# Altium project Micromouse.PrjPcb
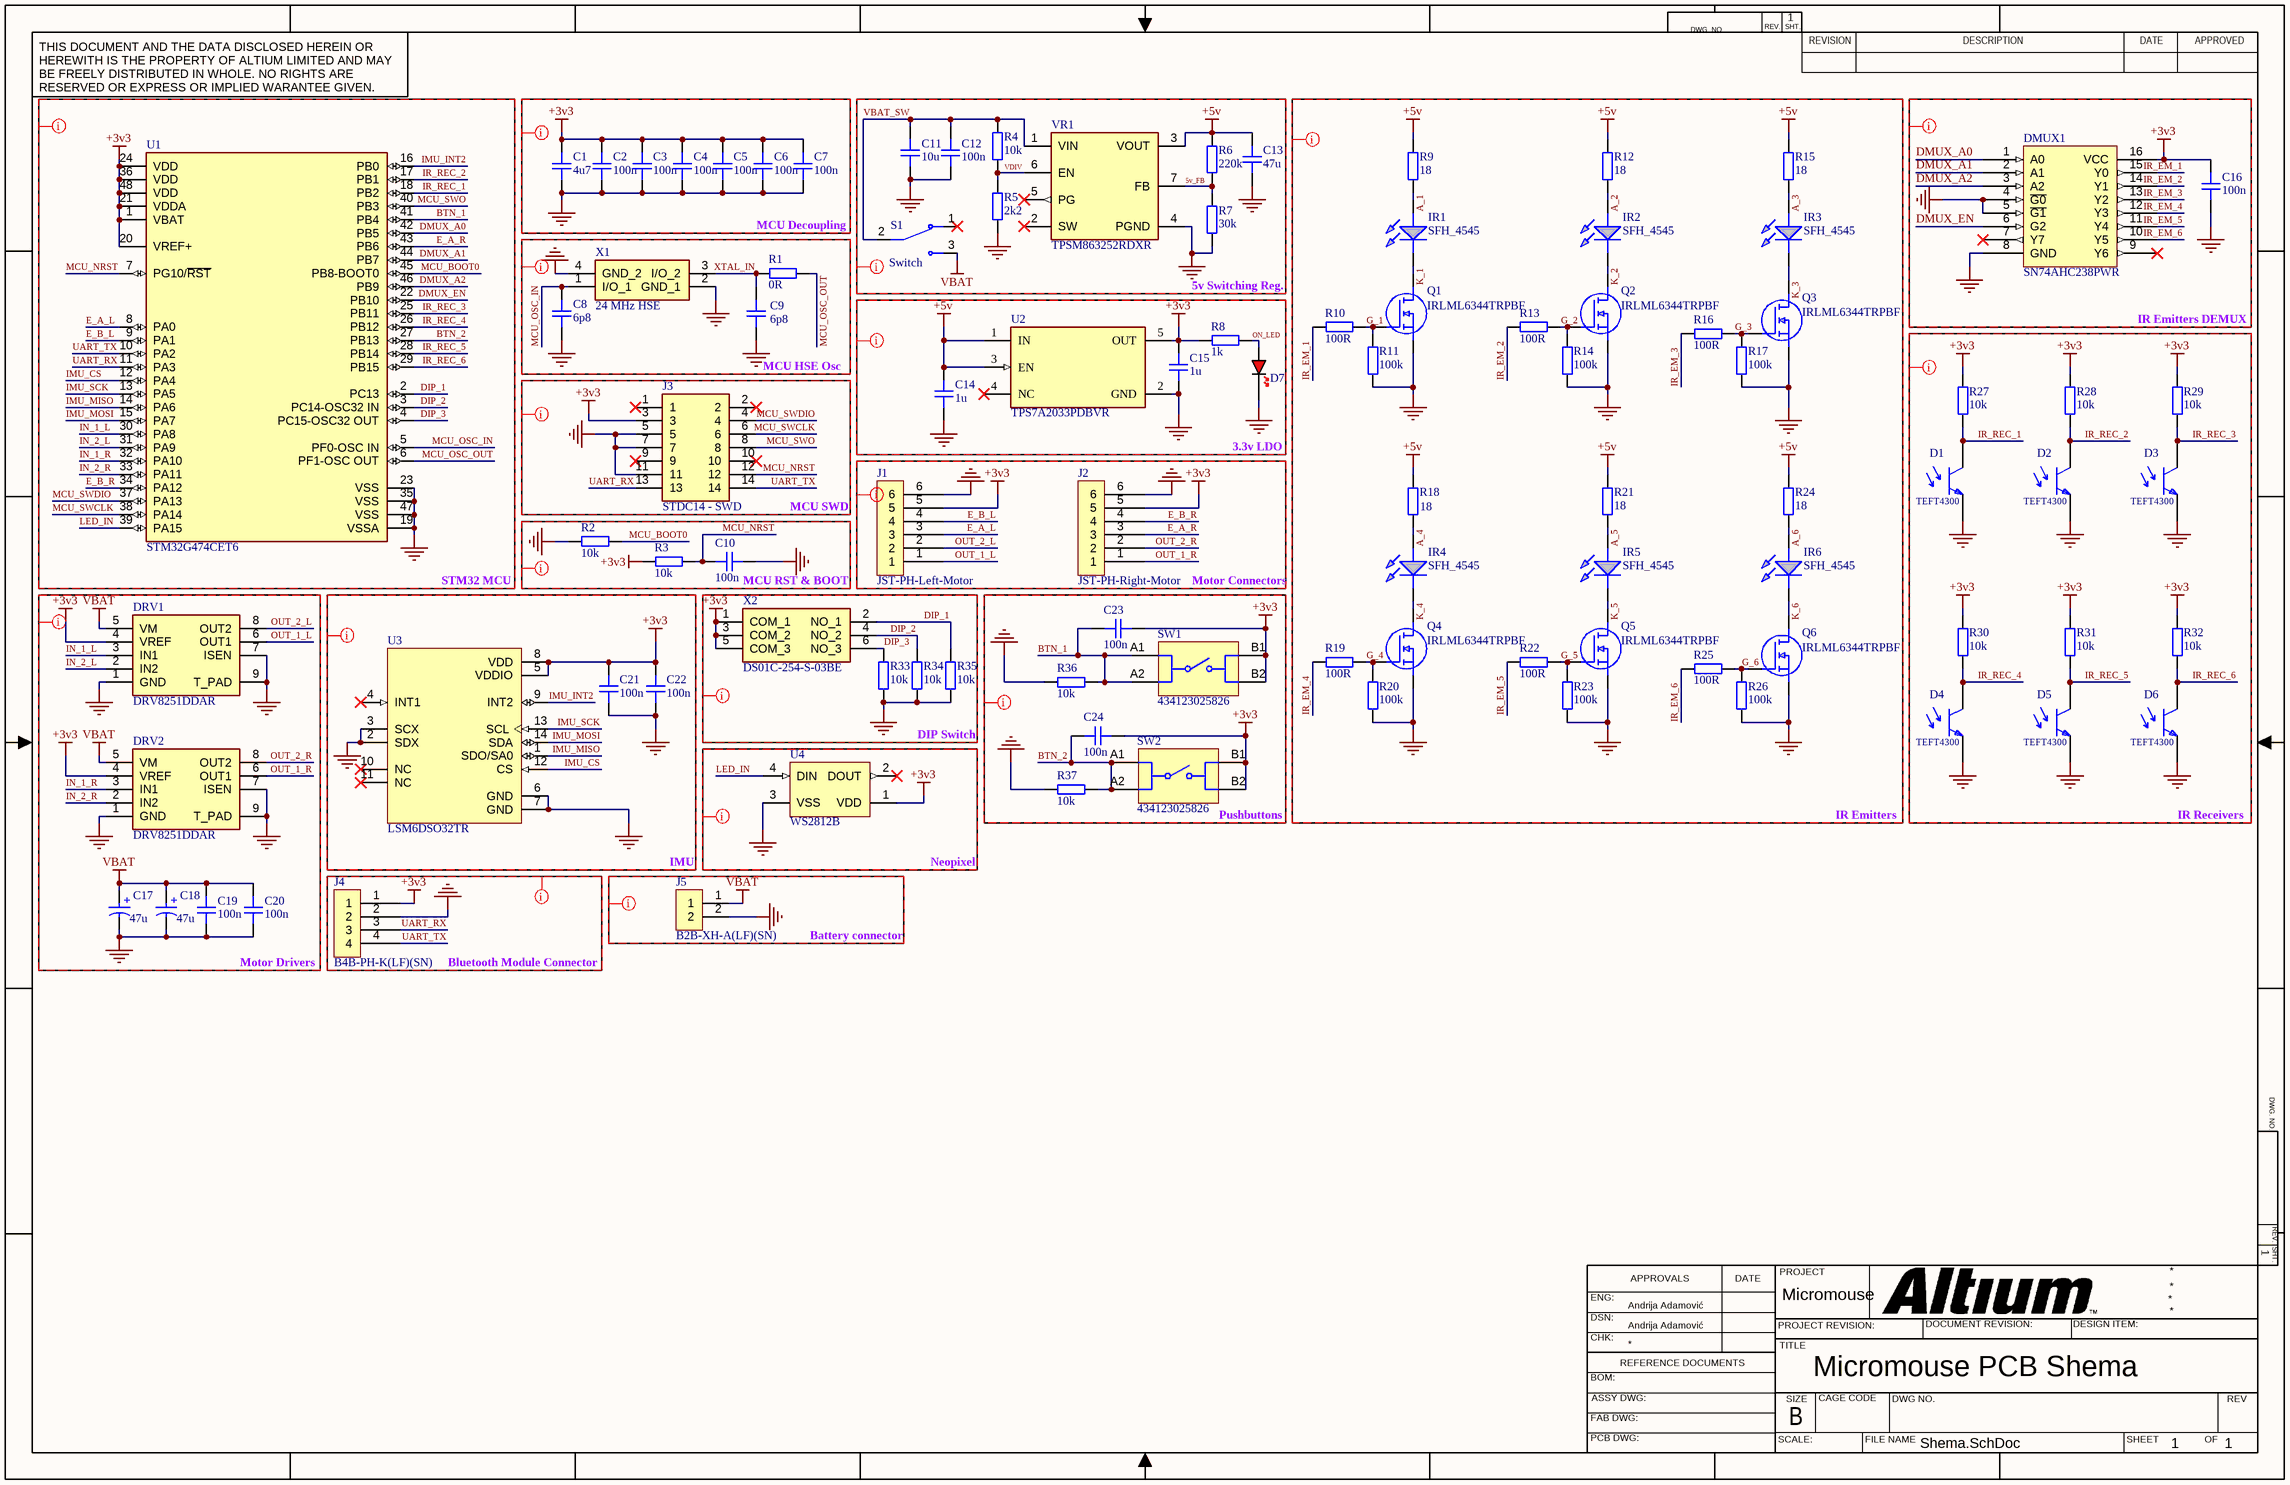
[diagram p0: Shema.SchDoc]
Project: Micromouse
1 sheet, 98 parts. Net scope: global (net labels, ports and power ports of the same name join across sheets).
Board file: Micromouse_PCB_Final.PcbDoc

## Sheet Shema.SchDoc: Micromouse PCB Shema
size 431 x 279 mm; Author: Andrija Adamović; DrawnBy: Andrija Adamović; Engineer: Andrija Adamović; Revision: 1; SheetNumber: 1; SheetTotal: 1

### Parts
C1  4u7  [CAP_0603]
C2  100n  [CAP_0603]
C3  100n  [CAP_0603]
C4  100n  [CAP_0603]
C5  100n  [CAP_0603]
C6  100n  [CAP_0603]
C7  100n  [CAP_0603]
C8  6p8  [CAP_0603]
C9  6p8  [CAP_0603]
C10  100n  [CAP_0603]
C11  10u  [CAP_0805]
C12  100n  [CAP_0603]
C13  47u  [CAP_1206]
C14  1u  [CAP_0805]
C15  1u  [CAP_0805]
C16  100n  [CAP_0603]
C17  47u  [WCAP-ASLI_D6.3H5.5]
C18  47u  [WCAP-ASLI_D6.3H5.5]
C19  100n  [CAP_0603]
C20  100n  [CAP_0603]
C21  100n  [CAP_0603]
C22  100n  [CAP_0603]
C23  100n  [CAP_0603]
C24  100n  [CAP_0603]
D1  TEFT4300  [FP-6_544-5269_01-4-MFG]
D2  TEFT4300  [FP-6_544-5269_01-4-MFG]
D3  TEFT4300  [FP-6_544-5269_01-4-MFG]
D4  TEFT4300  [FP-6_544-5269_01-4-MFG]
D5  TEFT4300  [FP-6_544-5269_01-4-MFG]
D6  TEFT4300  [FP-6_544-5269_01-4-MFG]
D7  RED  [LED_0603_RED]  (value not drawn)
DMUX1  SN74AHC238PWR  [TSOP65P640X120-16N]
DRV1  DRV8251DDAR  [SOIC127P600X170-9N]
DRV2  DRV8251DDAR  [SOIC127P600X170-9N]
IR1  SFH_4545  [SFH4545]
IR2  SFH_4545  [SFH4545]
IR3  SFH_4545  [SFH4545]
IR4  SFH_4545  [SFH4545]
IR5  SFH_4545  [SFH4545]
IR6  SFH_4545  [SFH4545]
J1  JST-PH-Left-Motor  [JST_B6B-PH-K-S(LF)(SN)]
J2  JST-PH-Right-Motor  [JST_B6B-PH-K-S(LF)(SN)]
J3  STDC14 - SWD  [FTSH10701LDVKTR]
J4  B4B-PH-K(LF)(SN)  [FP-B4B-PH-K_LF_SN-MFG]
J5  B2B-XH-A(LF)(SN)  [FP-B2B-XH-A_LF_SN-MFG]
Q1  IRLML6344TRPBF  [SOT95P237X112-3N]
Q2  IRLML6344TRPBF  [SOT95P237X112-3N]
Q3  IRLML6344TRPBF  [SOT95P237X112-3N]
Q4  IRLML6344TRPBF  [SOT95P237X112-3N]
Q5  IRLML6344TRPBF  [SOT95P237X112-3N]
Q6  IRLML6344TRPBF  [SOT95P237X112-3N]
R1  0R  [RES_0402]
R2  10k  [RES_0603]
R3  10k  [RES_0603]
R4  10k  [RES_0603]
R5  2k2  [RES_0603]
R6  220k  [RES_0603]
R7  30k  [RES_0603]
R8  1k  [RES_0603]
R9  18  [RES_1206]
R10  100R  [RES_0603]
R11  100k  [RES_0603]
R12  18  [RES_1206]
R13  100R  [RES_0603]
R14  100k  [RES_0603]
R15  18  [RES_1206]
R16  100R  [RES_0603]
R17  100k  [RES_0603]
R18  18  [RES_1206]
R19  100R  [RES_0603]
R20  100k  [RES_0603]
R21  18  [RES_1206]
R22  100R  [RES_0603]
R23  100k  [RES_0603]
R24  18  [RES_1206]
R25  100R  [RES_0603]
R26  100k  [RES_0603]
R27  10k  [RES_0603]
R28  10k  [RES_0603]
R29  10k  [RES_0603]
R30  10k  [RES_0603]
R31  10k  [RES_0603]
R32  10k  [RES_0603]
R33  10k  [RES_0603]
R34  10k  [RES_0603]
R35  10k  [RES_0603]
R36  10k  [RES_0603]
R37  10k  [RES_0603]
S1  Switch  [SW_SLW-864574-5A-RA-N-D]
SW1  434123025826  [434123025826]
SW2  434123025826  [434123025826]
U1  STM32G474CET6  [FP-STM32G474CET6-MFG]
U2  TPS7A2033PDBVR  [FP-DBV0005A-MFG]
U3  LSM6DSO32TR  [XDCR_LSM6DSO32TR]
U4  WS2812B  [ADAI-WS2812B_V]
VR1  TPSM863252RDXR  [VREG_TPSM863252RDXR]
X1  24 MHz HSE  [CX2016FB24000B0FZZH1]
X2  DS01C-254-S-03BE  [DS01C254S03BE]

### Blocks framed on the sheet
STM32 MCU: U1
MCU Decoupling: C1-C7
5v Switching Reg.: C11-C13 R4-R7 S1 VR1
IR Emitters: IR1-IR6 Q1-Q6 R9-R26
IR Emitters DEMUX: C16 DMUX1
MCU HSE Osc: C8 C9 R1 X1
IR Receivers: D1-D6 R27-R32
MCU SWD: J3
Motor Drivers: C17-C20 DRV1 DRV2
Bluetooth Module Connector: J4

### Nets
+3v3: C1.2 C2.2 C3.2 C4.2 C5.2 C6.2 C7.2 C15.2 C16.2 C21.1 C22.1 C23.1 C24.1 DMUX1.16(VCC) DRV1.4(VREF) DRV2.4(VREF) J1.5 J2.5 J3.3 J4.1 R3.1 R8.2 R27.2 R28.2 R29.2 R30.2 R31.2 R32.2 SW1.B1 SW1.B2 SW2.B1 SW2.B2 U1.1(VBAT) U1.20(VREF+) U1.21(VDDA) U1.24(VDD) U1.36(VDD) U1.48(VDD) U2.5(OUT) U3.5(VDDIO) U3.8(VDD) U4.1(VDD) X2.1(COM_1) X2.3(COM_2) X2.5(COM_3)
+5v: C13.2 C14.2 R6.2 R9.2 R12.2 R15.2 R18.2 R21.2 R24.2 U2.1(IN) U2.3(EN) VR1.3(VOUT)
GND: C1.1 C2.1 C3.1 C4.1 C5.1 C6.1 C7.1 C8.1 C9.1 C10.2 C11.1 C12.1 C13.1 C14.1 C15.1 C16.1 C17.2(N) C18.2(N) C19.1 C20.1 C21.2 C22.2 D1.1(E) D2.1(E) D3.1(E) D4.1(E) D5.1(E) D6.1(E) D7.K DMUX1.4(~{G0}) DMUX1.5(~{G1}) DMUX1.8(GND) DRV1.1(GND) DRV1.7(ISEN) DRV1.9(T_PAD) DRV2.1(GND) DRV2.7(ISEN) DRV2.9(T_PAD) J1.6 J2.6 J3.5 J3.7 J3.11 J4.2 J5.2 Q1.2(S) Q2.2(S) Q3.2(S) Q4.2(S) Q5.2(S) Q6.2(S) R2.1 R5.1 R7.1 R11.1 R14.1 R17.1 R20.1 R23.1 R26.1 R33.1 R34.1 R35.1 R36.1 R37.1 U1.19(VSSA) U1.23(VSS) U1.35(VSS) U1.47(VSS) U2.2(GND) U3.2(SDX) U3.3(SCX) U3.6(GND) U3.7(GND) U4.3(VSS) VR1.4(PGND) X1.2(GND_1) X1.4(GND_2)
VBAT: C17.1(P) C18.1(P) C19.2 C20.2 DRV1.5(VM) DRV2.5(VM) J5.1 S1.3
5v_FB: R6.1 R7.2 VR1.7(FB)
A_1: IR1.2(A) R9.1
A_2: IR2.2(A) R12.1
A_3: IR3.2(A) R15.1
A_4: IR4.2(A) R18.1
A_5: IR5.2(A) R21.1
A_6: IR6.2(A) R24.1
BTN_1: C23.2 R36.2 SW1.A1 SW1.A2 U1.41(PB4)
BTN_2: C24.2 R37.2 SW2.A1 SW2.A2 U1.27(PB13)
DIP_1: R35.2 U1.2(PC13) X2.2(NO_1)
DIP_2: R34.2 U1.3(PC14-OSC32_IN) X2.4(NO_2)
DIP_3: R33.2 U1.4(PC15-OSC32_OUT) X2.6(NO_3)
DMUX_A0: DMUX1.1(A0) U1.42(PB5)
DMUX_A1: DMUX1.2(A1) U1.44(PB7)
DMUX_A2: DMUX1.3(A2) U1.46(PB9)
DMUX_EN: DMUX1.6(G2) U1.22(PB10)
E_A_L: J1.3 U1.8(PA0)
E_A_R: J2.3 U1.43(PB6)
E_B_L: J1.4 U1.9(PA1)
E_B_R: J2.4 U1.34(PA12)
G_1: Q1.1(G) R10.2 R11.2
G_2: Q2.1(G) R13.2 R14.2
G_3: Q3.1(G) R16.2 R17.2
G_4: Q4.1(G) R19.2 R20.2
G_5: Q5.1(G) R22.2 R23.2
G_6: Q6.1(G) R25.2 R26.2
IMU_CS: U1.12(PA4) U3.12(CS)
IMU_INT2: U1.16(PB0) U3.9(INT2)
IMU_MISO: U1.14(PA6) U3.1(SDO/SA0)
IMU_MOSI: U1.15(PA7) U3.14(SDA)
IMU_SCK: U1.13(PA5) U3.13(SCL)
IN_1_L: DRV1.3(IN1) U1.30(PA8)
IN_1_R: DRV2.3(IN1) U1.32(PA10)
IN_2_L: DRV1.2(IN2) U1.31(PA9)
IN_2_R: DRV2.2(IN2) U1.33(PA11)
IR_EM_1: DMUX1.15(Y0) R10.1
IR_EM_2: DMUX1.14(Y1) R13.1
IR_EM_3: DMUX1.13(Y2) R16.1
IR_EM_4: DMUX1.12(Y3) R19.1
IR_EM_5: DMUX1.11(Y4) R22.1
IR_EM_6: DMUX1.10(Y5) R25.1
IR_REC_1: D1.2(C) R27.1 U1.18(PB2)
IR_REC_2: D2.2(C) R28.1 U1.17(PB1)
IR_REC_3: D3.2(C) R29.1 U1.25(PB11)
IR_REC_4: D4.2(C) R30.1 U1.26(PB12)
IR_REC_5: D5.2(C) R31.1 U1.28(PB14)
IR_REC_6: D6.2(C) R32.1 U1.29(PB15)
K_1: IR1.1(K) Q1.3(D)
K_2: IR2.1(K) Q2.3(D)
K_3: IR3.1(K) Q3.3(D)
K_4: IR4.1(K) Q4.3(D)
K_5: IR5.1(K) Q5.3(D)
K_6: IR6.1(K) Q6.3(D)
LED_IN: U1.39(PA15) U4.4(DIN)
MCU_BOOT0: R2.2 U1.45(PB8-BOOT0)
MCU_NRST: C10.1 J3.12 R3.2 U1.7(PG10/~{RST})
MCU_OSC_IN: C8.2 U1.5(PF0-OSC_IN) X1.1(I/O_1)
MCU_OSC_OUT: R1.2 U1.6(PF1-OSC_OUT)
MCU_SWCLK: J3.6 U1.38(PA14)
MCU_SWDIO: J3.4 U1.37(PA13)
MCU_SWO: J3.8 U1.40(PB3)
ON_LED: D7.A R8.1
OUT_1_L: DRV1.6(OUT1) J1.1
OUT_1_R: DRV2.6(OUT1) J2.1
OUT_2_L: DRV1.8(OUT2) J1.2
OUT_2_R: DRV2.8(OUT2) J2.2
UART_RX: J3.13 J4.3 U1.11(PA3)
UART_TX: J3.14 J4.4 U1.10(PA2)
VBAT_SW: C11.2 C12.2 R4.2 S1.2 VR1.1(VIN)
VDIV: R4.1 R5.2 VR1.6(EN)
XTAL_IN: C9.2 R1.1 X1.3(I/O_2)

Not connected (* = marked no-connect by the designer): DMUX1 7(Y7)* 9(Y6)*; J3 1* 2* 9* 10*; S1 1*; U2 4(NC)*; U3 4(INT1)* 10(NC)* 11(NC)*; U4 2(DOUT)*; VR1 2(SW)* 5(PG)*

### Layout directives
CompClassName: IR Emitters DEMUX: +3v3, DMUX_A0, DMUX_A1, DMUX_A2, DMUX_EN, GND, IR_EM_1, IR_EM_2, IR_EM_3, IR_EM_4, IR_EM_5, IR_EM_6
CompClassName: IR Receivers: +3v3, GND, IR_REC_1, IR_REC_2, IR_REC_3, IR_REC_4, IR_REC_5, IR_REC_6
CompClassName: 5v Switching Reg: 5v_FB, +5v, GND, VBAT, VBAT_SW, VDIV
CompClassName: 3.3v LDO: +3v3, +5v, GND, ON_LED
CompClassName: Motor Connectors: +3v3, E_A_L, E_A_R, E_B_L, E_B_R, GND, OUT_1_L, OUT_1_R, OUT_2_L, OUT_2_R
CompClassName: Pushbuttons: +3v3, BTN_1, BTN_2, GND
CompClassName: Neopixel: +3v3, GND, LED_IN
CompClassName: DIP Switch: +3v3, DIP_1, DIP_2, DIP_3, GND
CompClassName: IMU: +3v3, GND, IMU_CS, IMU_INT2, IMU_MISO, IMU_MOSI, IMU_SCK
CompClassName: Motor Drivers: +3v3, GND, IN_1_L, IN_1_R, IN_2_L, IN_2_R, OUT_1_L, OUT_1_R, OUT_2_L, OUT_2_R, VBAT
CompClassName: Bluetooth Module Connector: +3v3, GND, UART_RX, UART_TX
CompClassName: Battery connector: GND, VBAT
CompClassName: STM32 MCU: +3v3, BTN_1, BTN_2, DIP_1, DIP_2, DIP_3, DMUX_A0, DMUX_A1, DMUX_A2, DMUX_EN, E_A_L, E_A_R, E_B_L, E_B_R, GND, IMU_CS, IMU_INT2, IMU_MISO, IMU_MOSI, IMU_SCK, IN_1_L, IN_1_R, IN_2_L, IN_2_R, IR_REC_1, IR_REC_2, IR_REC_3, IR_REC_4, IR_REC_5, IR_REC_6, LED_IN, MCU_BOOT0, MCU_NRST, MCU_OSC_IN, MCU_OSC_OUT, MCU_SWCLK, MCU_SWDIO, MCU_SWO, UART_RX, UART_TX
CompClassName: MCU Decoupling: +3v3, GND
CompClassName: MCU HSE Osc: GND, MCU_OSC_IN, MCU_OSC_OUT, XTAL_IN
CompClassName: MCU SWD: +3v3, GND, MCU_NRST, MCU_SWCLK, MCU_SWDIO, MCU_SWO, UART_RX, UART_TX
CompClassName: MCU RST & BOOT: +3v3, GND, MCU_BOOT0, MCU_NRST
CompClassName: IR Emitters: +5v, A_1, A_2, A_3, A_4, A_5, A_6, G_1, G_2, G_3, G_4, G_5, G_6, GND, IR_EM_1, IR_EM_2, IR_EM_3, IR_EM_4, IR_EM_5, IR_EM_6, K_1, K_2, K_3, K_4, K_5, K_6

### Notes on the sheet
- 3.3v LDO
- (near C10) MCU RST & BOOT
- Motor Connectors
- DIP Switch
- (near SW2) Pushbuttons
- (near J5) IMU
- Neopixel
- Battery connector
- DWG. NO.
- REV.
- SHT.
- THIS DOCUMENT AND THE DATA DISCLOSED HEREIN OR HEREWITH IS THE PROPERTY OF ALTIUM LIMITED AND MAY BE FREELY DISTRIBUTED IN WHOLE. NO RIGHTS ARE RESERVED OR EXPRESS OR IMPLIED WARANTEE GIVEN.
- REVISION
- DESCRIPTION
- DATE
- APPROVED
- ENG:
- APPROVALS
- PROJECT
- DSN:
- CHK:
- REFERENCE DOCUMENTS
- PROJECT REVISION:
- TITLE
- DOCUMENT REVISION:
- DESIGN ITEM:
- BOM:
- FAB DWG:
- PCB DWG:
- ASSY DWG:
- SCALE:
- SIZE
- B
- CAGE CODE
- FILE NAME
- DWG NO.
- SHEET
- OF
- REV
- (in symbol CMP-03913-53914590-2) +

### Library data of the parts
C1-C10 C12 C16 C19-C24 = CAP_0603: Capacitor SMD 0603; Manufacturer: *; Manufacturer Part Number: *; Distributor Link: *; LCSC: *; Rating: *; Dielectric: *
C11 C14 C15 = CAP_0805: Capacitor SMD 0805; Manufacturer: *; Manufacturer Part Number: *; Distributor Link: *; LCSC: *; Rating: *; Dielectric: *
C13 = CAP_1206: Capacitor SMD 1206; Manufacturer: *; Manufacturer Part Number: *; Distributor Link: *; LCSC: *; Rating: *; Dielectric: *
C17 C18 = CMP-03913-53914590-2: WCAP-ASLI Aluminum Electrolytic Capacitors; Capacitance: 47µF; Life (Hours): 2000hours; ESR (Equivalent Series Resistance): 397.678mΩ; Voltage Rating (DC): 25V; Impedance: 560mΩ; Leakage Current: 11.75µA; Insulation Resistance: 2.12766MΩ; Polarity: Polar; Ripple Current (AC): 220mA; Tolerance: 20%; Width: 6.6mm; REACH SVHC: Unknown; Min Operating Temperature: -55°C; Length: 5.5mm; Diameter: 6.3mm; Voltage Rating: 25V; Height - Seated (Max): 5.5118mm; Mount: Surface Mount; RoHS: Compliant; Max Operating Temperature: 105°C; Height: 5.5mm; Case/Package: Radial; Ripple Current: 220mA
D1-D6 = CMP-00030-39729854-1: TEFT4300 PHOTOTRANSISTOR 3.0MM WIDE VIEW / Phototransistor IR Chip Silicon 925nm 2-Pin T-1; Polarity: NPN; Lens Style: Domed; Max Power Dissipation: 100mW; Viewing Angle: 30°; Collector Emitter Breakdown Voltage: 70V; Number of Elements: 1; Rise Time: 2µs; Dark Current: 200nA; Collector Emitter Saturation Voltage: 300mV; Fall Time: 2.3µs; Max Collector Current: 50mA; Max Operating Temperature: 100°C; Schedule B: 8541407080, 8541407080; Min Operating Temperature: -40°C; Orientation: Top View; Height: 4.5mm; Radiation Hardening: No; Power Consumption: 100mW; RoHS: Compliant; Case/Package: T; Lead Free: Lead Free; REACH SVHC: Unknown; NexarPartId: 39729854; Mount: Through Hole; Wavelength: 925nm; Power Dissipation: 100mW; Number of Channels: 1; Number of Pins: 2; Collector Emitter Voltage (VCEO): 70V; Width: 3.9mm; Length: 3.2mm
D7 = LED_0603_RED: LED 0603 RED SMD
DMUX1 = CMP-015-00008-1: 3-line to 8-line inverting and noninverting decoder and demultiplexer with high-speed CMOS logic 16-TSSOP -40 to 125; Pins: 16; Case/Package: TSSOP
DRV1 DRV2 = CMP-051-000000-5: Motor Drives; Manufacturer_Name: Texas Instruments; Geometry.Height: 1.7mm; Mouser Price/Stock: https://www.mouser.co.uk/ProductDetail/Texas-Instruments/DRV8251DDAR?qs=doiCPypUmgHTzZyfapGahQ%3D%3D; Datasheet Link: https://www.arrow.com/en/products/drv8251ddar/texas-instruments?region=nac; Manufacturer_Part_Number: DRV8251DDAR; Design Item ID: DRV8251DDAR; Source: DRV8251DDAR.SchLib; Mouser Part Number: 595-DRV8251DDAR
IR1-IR6 = CMP-004-00035-3: SFH 4545 Osram Opto, 950nm IR LED, 5 mm Through Hole package; Manufacturer_Name: ams OSRAM; Geometry.Height: 8.3mm; Source: SFH_4545.SchLib; Manufacturer_Part_Number: SFH 4545; Mouser Part Number: 720-SFH4545; Mouser Price/Stock: https://www.mouser.co.uk/ProductDetail/ams-OSRAM/SFH-4545?qs=VcOkZLzzaubOJpq6Xyji1A%3D%3D; Datasheet Link: https://datasheet.datasheetarchive.com/originals/distributors/DKDS41/DSANUWW0036915.pdf; Design Item ID: SFH_4545
J1 J2 = CMP-067-000000-3: Socket; wire-board; male; PH; 2mm; PIN: 6; THT; 100V; 2A; -25÷85°C; MF: {'manufacturer': u'JST Sales America Inc.'}; Pin Count: 6; Component Type: Standard; Availability: Unavailable; Design Item ID: B6B-PH-K-S(LF)(SN); Price: None; Source: B6B-PH-K-S(LF)(SN).SchLib; Value: *; MP: B6B-PH-K-S(LF)(SN); Package: None
J3 = CMP-002-00074-2: Conn Unshrouded Header HDR 14 POS 1.27mm Solder ST Top Entry SMD TIGER CLAW T/R; Manufacturer_Name: SAMTEC; Geometry.Height: 6.25mm; Datasheet Link: https://suddendocs.samtec.com/prints/ftsh-1xx-xx-xxx-dv-xxx-xxx-x-xx-mkt.pdf?_gl=1*mdiyn1*_ga*MTcyMTUxMTIwMy4xNzEyMDQxMTc2*_ga_3KFNZC07WW*MTcxMjEzMDIxOS4yLjEuMTcxMjEzMDI1NC4yNS4wLjA.; Design Item ID: FTSH-107-01-L-DV-K-TR; Mouser Part Number: 200-FTSH10701LDVKTR; Source: FTSH-107-01-L-DV-K-TR.SchLib; Mouser Price/Stock: https://www.mouser.co.uk/ProductDetail/Samtec/FTSH-107-01-L-DV-K-TR?qs=%252BZP6%2F%252BtExtDlh0wyxE013Q%3D%3D; Manufacturer_Part_Number: FTSH-107-01-L-DV-K-TR
J4 = CMP-002-00075-2: Conn Shrouded Header (4 Sides) HDR 4 POS 2mm Solder ST Thru-Hole Box; Connector Type: Male Pin; Voltage Rating: 100V; Mounting Technology: Through Hole; Min Operating Temperature: -25°C; Max Operating Temperature: 85°C; Pins: 4
J5 = CMP-002-00076-1: CONNECTOR HEADER, XH SERIES, 2 POSITION, 2.50MM, Press-Fit Solder, Detent Lock, Natural; Connector Type: Male Pin; Max Current Rating: 3A; Voltage Rating: 250V; Mounting Technology: Through Hole; Min Operating Temperature: -25°C; Pins: 2; Max Operating Temperature: 85°C
Q1-Q6 = CMP-072-000000-2: IRLML6344TRPBF N-channel MOSFET Transistor, 5 A, 30 V, 3-Pin SOT-23; Manufacturer_Name: Infineon; Geometry.Height: 1.12mm; Source: IRLML6344TRPBF.SchLib; Mouser Price/Stock: https://www.mouser.co.uk/ProductDetail/Infineon-Technologies/IRLML6344TRPBF?qs=9%252BKlkBgLFf2w4qS48UOXVw%3D%3D; Datasheet Link: https://www.infineon.com/dgdl/irlml6344pbf.pdf?fileId=5546d462533600a4015356689c44262c; Manufacturer_Part_Number: IRLML6344TRPBF; Mouser Part Number: 942-IRLML6344TRPBF; Design Item ID: IRLML6344TRPBF
R1 = RES_0402: Resistor SMD 0402; Manufacturer: *; Manufacturer Part Number: *; Distributor Link: *; LCSC: *
R2-R8 R10 R11 R13 R14 R16 R17 R19 R20 R22 R23 R25-R37 = RES_0603: Resistor SMD 0603; Manufacturer: *; Manufacturer Part Number: *; Distributor Link: *; LCSC: *
R9 R12 R15 R18 R21 R24 = RES_1206: Resistor SMD 1206; Manufacturer: *; Manufacturer Part Number: *; Distributor Link: *; LCSC: *
S1 = CMP-069-000000-2: 8.6 x 4.5 x 6.2 mm, 5 mm Raised Slide Actuator, Right Angle, Through Hole, Slide Switch; MF: {'manufacturer': u'Same Sky (Formerly CUI Devices)'}; Availability: Unavailable; MP: SLW-864574-5A-RA-N-D; Pin Count: 3; Price: None; Component Type: Standard; Source: SLW-864574-5A-RA-N-D.SchLib; Package: None; Value: *; Design Item ID: SLW-864574-5A-RA-N-D
SW1 SW2 = CMP-011-00013-1: Tactile Switch, 0.05A, 16Vdc, 260Gf, Smd Rohs Compliant: Yes; Voltage Rating: 16V; Current Rating: 50mA; Throw Configuration: SPST; Max Operating Temperature: 85°C; Min Operating Temperature: -40°C; Mounting Technology: Surface Mount; RoHS Compliant: Yes
U1 = CMP-12105-000053-1: MAINSTREAM ARM CORTEX-M4 CORE WI; Manufacturer: STMicroelectronics; Number Of Usb Channels: 1; Number Of Uart Channels: 4; Number Of Adc Channels: 20; Ram Size: 128KBytes; Standoff Height: 0.05mm; Number Of A/D Converters: 5; Number Of I/Os: 38; Max Supply Voltage: 3.6V; Frequency: 170MHz; Min Supply Voltage: 1.62V; Interface: I2C,SPI,UART,USART,CAN,USB,LIN,IrDA,I2S,SMBus,Other; Memory Size: 512KBytes; Max Junction Temp: +105°C; Number Of Spi Channels: 3; Number Of Pwm Channels: 12; Memory Type: FLASH; Number Of Timers/Counters: 14; Data Bus Width: 32bits; Temperature Range Low: -40°C; RoHS: TRUE; Automotive: No; Octopart: https://octopart.com/stm32g474cet6-stmicroelectronics-99072248; ComponentLink2URL: https://www.st.com/resource/en/datasheet/stm32g474ce.pdf; Ambient Temperature Range Low: -40°C; Temperature Range High: +85°C; Manufacturer Part Number: STM32G474CET6; Ambient Temperature Range High: +85°C; ComponentLink2Description: Datasheet; Device Class L1: Integrated Circuits (ICs); Temperature: -40°C to +85°C; Device Class L3: Microcontrollers; Number Of I2C Channels: 4; Device Class L2: Embedded Processors and Controllers; Category: IC; Mouser Description: Cortex M4 512K LQFP48 85°C; Number Of Cores: 1; Digikey Description: MAINSTREAM ARM CORTEX-M4 CORE WI; Core Architecture: ARM Cortex-M4; Height: 1.6mm; Package: LQFP48; Lead Free: Yes
U2 = CMP-04917-000300-1: IC REG LINEAR 3.3V 300MA SOT23-5; RoHS Compliant: Yes
U3 = CMP-074-000000-3: Accelerometer, Gyroscope, Temperature, 6 Axis Sensor IÂ²C, SPI Output; MF: STMicroelectronics; Check_prices: https://www.snapeda.com/parts/LSM6DSO32TR/STMicroelectronics/view-part/?ref=eda; MP: LSM6DSO32TR; Design Item ID: LSM6DSO32TR; Component Type: Standard; Package: VFLGA-14 STMicroelectronics; Source: LSM6DSO32TR.SchLib; SnapEDA_Link: https://www.snapeda.com/parts/LSM6DSO32TR/STMicroelectronics/view-part/?ref=snap; Value: *; Pin Count: 14
U4 = CMP-007-00035-2: Intelligent Control LED Integrated Light Source, 3.5 to 5.3 V, -25 to 80 degC, 4-Pin SMD, RoHS, Bulk; Manufacturer: Adafruit Industries; Datasheet URL: https://cdn-shop.adafruit.com/datasheets/WS2812B.pdf; Manufacturer URL: https://www.adafruit.com/; Datasheet Version: May-13; Case/Package: WS2812B; Mounting Technology: SM; RoHS Compliant: False; Package Description: 4-Pin Surface Mount Device, Body 5 x 5 mm, Pitch 3.3 mm; Package Reference: WS2812B
VR1 = CMP-053-000000-4: 3-V to 17-V input voltage, 3-A Eco-mode synchronous buck module; MF: Texas Instruments; Design Item ID: TPSM863252RDXR; SnapEDA_Link: https://www.snapeda.com/parts/TPSM863252RDXR/Texas+Instruments/view-part/?ref=snap; MP: TPSM863252RDXR; Check_prices: https://www.snapeda.com/parts/TPSM863252RDXR/Texas+Instruments/view-part/?ref=eda; Source: TPSM863252RDXR.SchLib; Component Type: Standard; Value: *; Pin Count: 7; Package: PowerFQFN-7 Texas Instruments
X1 = CMP-031-000000-2: Crystals 2.0x1.6mm 24MHz 6pF - 40 C to + 85 C 50 Ohms; Manufacturer_Name: Kyocera AVX; Geometry.Height: 0.55mm; Datasheet Link: https://ele.kyocera.com/assets/products/crystal-device/specification/CX2016FB_6pF.pdf; Design Item ID: CX2016FB24000B0FZZH1; Manufacturer_Part_Number: CX2016FB24000B0FZZH1; Mouser Part Number: *; Mouser Price/Stock: *; Source: CX2016FB24000B0FZZH1.SchLib
X2 = CMP-011-00014-2: DS01C-254-S-03BE - 3 Position, Through Hole, 2.54 mm Pitch, Raised Slide Actuator, Convex Bottom, Short Pin, DIP Switch; Manufacturer_Name: Same Sky; Geometry.Height: 7mm; Mouser Price/Stock: https://www.mouser.co.uk/ProductDetail/CUI-Devices/DS01C-254-S-03BE?qs=wnTfsH77Xs7A4kzYuxObfg%3D%3D; Mouser Part Number: 490-DS01C-254-S-03BE; Source: DS01C-254-S-03BE.SchLib; Datasheet Link: https://www.sameskydevices.com/product/resource/DS01C-254-S-03BE.pdf; Design Item ID: DS01C-254-S-03BE; Manufacturer_Part_Number: DS01C-254-S-03BE